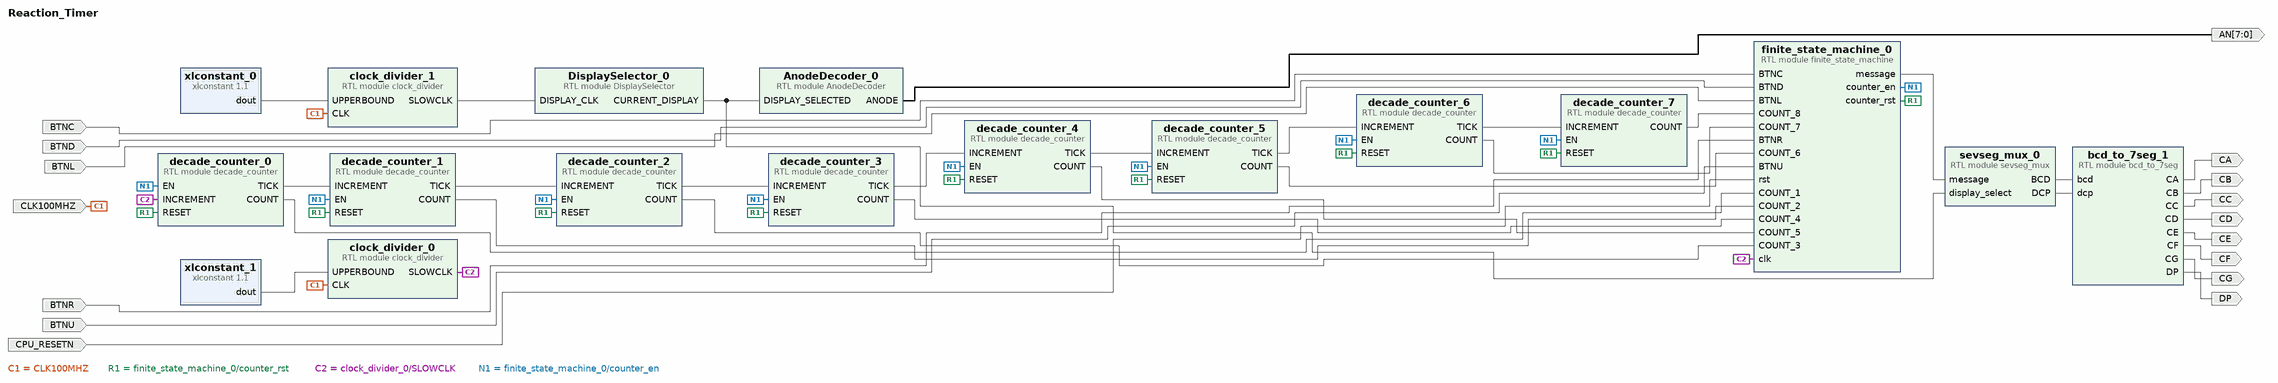
[diagram p0: block diagram of the top level]
# Vivado block design Reaction_Timer, xc7a100tcsg324-1, Vivado 2022.2
create_bd_design Reaction_Timer

create_bd_port -dir I BTNC
create_bd_port -dir I CPU_RESETN
create_bd_port -dir I CLK100MHZ
create_bd_port -dir O -from 7 -to 0 AN
create_bd_port -dir O CA
create_bd_port -dir O CB
create_bd_port -dir O CC
create_bd_port -dir O CD
create_bd_port -dir O CE
create_bd_port -dir O CF
create_bd_port -dir O CG
create_bd_port -dir O DP
create_bd_port -dir I BTNU
create_bd_port -dir I BTND
create_bd_port -dir I BTNR
create_bd_port -dir I BTNL

create_bd_cell -type module -reference AnodeDecoder AnodeDecoder_0
create_bd_cell -type module -reference decade_counter decade_counter_0
create_bd_cell -type module -reference decade_counter decade_counter_1
create_bd_cell -type module -reference decade_counter decade_counter_2
create_bd_cell -type module -reference decade_counter decade_counter_3
create_bd_cell -type module -reference DisplaySelector DisplaySelector_0
create_bd_cell -type module -reference clock_divider clock_divider_0
create_bd_cell -type module -reference bcd_to_7seg bcd_to_7seg_1
create_bd_cell -type module -reference clock_divider clock_divider_1
create_bd_cell -type ip -vlnv xilinx.com:ip:xlconstant:1.1 xlconstant_0
set_property -dict {CONFIG.CONST_VAL 16960 CONFIG.CONST_WIDTH 28} [get_bd_cells xlconstant_0]
create_bd_cell -type ip -vlnv xilinx.com:ip:xlconstant:1.1 xlconstant_1
set_property -dict {CONFIG.CONST_VAL 16960 CONFIG.CONST_WIDTH 28} [get_bd_cells xlconstant_1]
create_bd_cell -type module -reference sevseg_mux sevseg_mux_0
create_bd_cell -type module -reference decade_counter decade_counter_4
create_bd_cell -type module -reference decade_counter decade_counter_5
create_bd_cell -type module -reference decade_counter decade_counter_6
create_bd_cell -type module -reference decade_counter decade_counter_7
create_bd_cell -type module -reference finite_state_machine finite_state_machine_0

# ---- connections ----

connect_bd_net [get_bd_pins AnodeDecoder_0/ANODE] [get_bd_ports AN]
connect_bd_net [get_bd_ports BTNC] [get_bd_pins finite_state_machine_0/BTNC]
connect_bd_net [get_bd_ports BTND] [get_bd_pins finite_state_machine_0/BTND]
connect_bd_net [get_bd_ports BTNL] [get_bd_pins finite_state_machine_0/BTNL]
connect_bd_net [get_bd_ports BTNR] [get_bd_pins finite_state_machine_0/BTNR]
connect_bd_net [get_bd_ports BTNU] [get_bd_pins finite_state_machine_0/BTNU]
connect_bd_net [get_bd_ports CLK100MHZ] [get_bd_pins clock_divider_0/CLK] [get_bd_pins clock_divider_1/CLK]
connect_bd_net [get_bd_ports CPU_RESETN] [get_bd_pins finite_state_machine_0/rst]
connect_bd_net [get_bd_pins DisplaySelector_0/CURRENT_DISPLAY] [get_bd_pins AnodeDecoder_0/DISPLAY_SELECTED] [get_bd_pins sevseg_mux_0/display_select]
connect_bd_net [get_bd_pins finite_state_machine_0/counter_rst] \
  [get_bd_pins decade_counter_2/RESET] [get_bd_pins decade_counter_1/RESET] [get_bd_pins decade_counter_0/RESET] \
  [get_bd_pins decade_counter_3/RESET] [get_bd_pins decade_counter_4/RESET] [get_bd_pins decade_counter_5/RESET] \
  [get_bd_pins decade_counter_6/RESET] [get_bd_pins decade_counter_7/RESET]
connect_bd_net [get_bd_pins bcd_to_7seg_1/CA] [get_bd_ports CA]
connect_bd_net [get_bd_pins bcd_to_7seg_1/CB] [get_bd_ports CB]
connect_bd_net [get_bd_pins bcd_to_7seg_1/CC] [get_bd_ports CC]
connect_bd_net [get_bd_pins bcd_to_7seg_1/CD] [get_bd_ports CD]
connect_bd_net [get_bd_pins bcd_to_7seg_1/CE] [get_bd_ports CE]
connect_bd_net [get_bd_pins bcd_to_7seg_1/CF] [get_bd_ports CF]
connect_bd_net [get_bd_pins bcd_to_7seg_1/CG] [get_bd_ports CG]
connect_bd_net [get_bd_pins bcd_to_7seg_1/DP] [get_bd_ports DP]
connect_bd_net [get_bd_pins clock_divider_0/SLOWCLK] [get_bd_pins decade_counter_0/INCREMENT] [get_bd_pins finite_state_machine_0/clk]
connect_bd_net [get_bd_pins clock_divider_1/SLOWCLK] [get_bd_pins DisplaySelector_0/DISPLAY_CLK]
connect_bd_net [get_bd_pins decade_counter_0/COUNT] [get_bd_pins finite_state_machine_0/COUNT_1]
connect_bd_net [get_bd_pins decade_counter_0/TICK] [get_bd_pins decade_counter_1/INCREMENT]
connect_bd_net [get_bd_pins decade_counter_1/COUNT] [get_bd_pins finite_state_machine_0/COUNT_2]
connect_bd_net [get_bd_pins decade_counter_1/TICK] [get_bd_pins decade_counter_2/INCREMENT]
connect_bd_net [get_bd_pins decade_counter_2/COUNT] [get_bd_pins finite_state_machine_0/COUNT_3]
connect_bd_net [get_bd_pins decade_counter_2/TICK] [get_bd_pins decade_counter_3/INCREMENT]
connect_bd_net [get_bd_pins decade_counter_3/COUNT] [get_bd_pins finite_state_machine_0/COUNT_4]
connect_bd_net [get_bd_pins decade_counter_3/TICK] [get_bd_pins decade_counter_4/INCREMENT]
connect_bd_net [get_bd_pins decade_counter_4/COUNT] [get_bd_pins finite_state_machine_0/COUNT_5]
connect_bd_net [get_bd_pins decade_counter_4/TICK] [get_bd_pins decade_counter_5/INCREMENT]
connect_bd_net [get_bd_pins decade_counter_5/COUNT] [get_bd_pins finite_state_machine_0/COUNT_6]
connect_bd_net [get_bd_pins decade_counter_5/TICK] [get_bd_pins decade_counter_6/INCREMENT]
connect_bd_net [get_bd_pins decade_counter_6/COUNT] [get_bd_pins finite_state_machine_0/COUNT_7]
connect_bd_net [get_bd_pins decade_counter_6/TICK] [get_bd_pins decade_counter_7/INCREMENT]
connect_bd_net [get_bd_pins decade_counter_7/COUNT] [get_bd_pins finite_state_machine_0/COUNT_8]
connect_bd_net [get_bd_pins finite_state_machine_0/counter_en] \
  [get_bd_pins decade_counter_3/EN] [get_bd_pins decade_counter_0/EN] [get_bd_pins decade_counter_1/EN] \
  [get_bd_pins decade_counter_2/EN] [get_bd_pins decade_counter_4/EN] [get_bd_pins decade_counter_5/EN] \
  [get_bd_pins decade_counter_6/EN] [get_bd_pins decade_counter_7/EN]
connect_bd_net [get_bd_pins finite_state_machine_0/message] [get_bd_pins sevseg_mux_0/message]
connect_bd_net [get_bd_pins sevseg_mux_0/BCD] [get_bd_pins bcd_to_7seg_1/bcd]
connect_bd_net [get_bd_pins sevseg_mux_0/DCP] [get_bd_pins bcd_to_7seg_1/dcp]
connect_bd_net [get_bd_pins xlconstant_0/dout] [get_bd_pins clock_divider_1/UPPERBOUND]
connect_bd_net [get_bd_pins xlconstant_1/dout] [get_bd_pins clock_divider_0/UPPERBOUND]

validate_bd_design
save_bd_design
